# EAGLE design untitled (EAGLE 7.2.0)
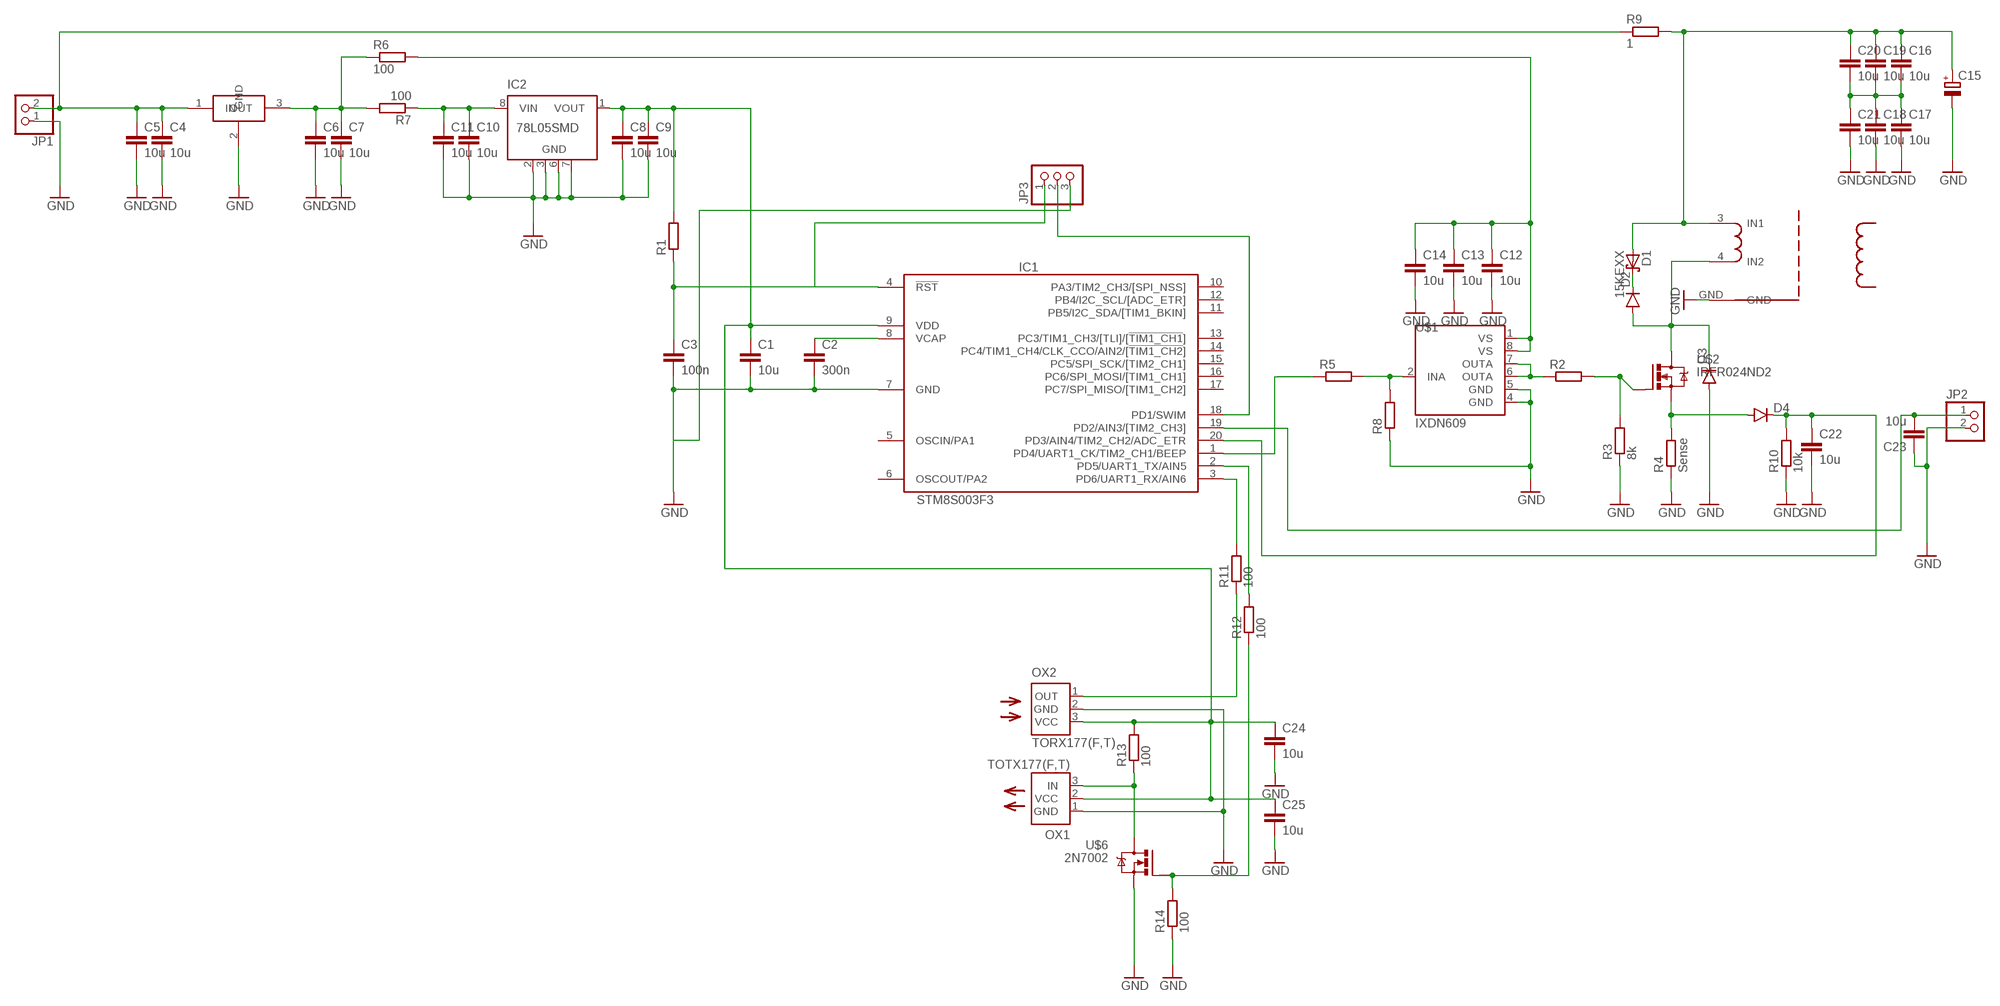
[diagram p0: schematic, sheet 1]

## Parts
C1  10u  CC0805  [C0805]
C2  300n  CC0805  [C0805]
C3  100n  CC0805  [C0805]
C4  10u  CC0805  [C0805]
C5  10u  CC0805  [C0805]
C6  10u  CC0805  [C0805]
C7  10u  CC0805  [C0805]
C8  10u  CC0805  [C0805]
C9  10u  CC0805  [C0805]
C10  10u  CC0805  [C0805]
C11  10u  CC0805  [C0805]
C12  10u  CC0805  [C0805]
C13  10u  CC0805  [C0805]
C14  10u  CC0805  [C0805]
C15  CPOL-EUE7.5-16  [E7,5-16]
C16  10u  CC0805  [C0805]
C17  10u  CC0805  [C0805]
C18  10u  CC0805  [C0805]
C19  10u  CC0805  [C0805]
C20  10u  CC0805  [C0805]
C21  10u  CC0805  [C0805]
C22  10u  CC0805  [C0805]
C23  10u  CC0805  [C0805]
C24  10u  CC0805  [C0805]
C25  10u  CC0805  [C0805]
D1  15KEXX  [CB429-17]
D2  DIODESMA  [SMA-DIODE]
D3  DIODESMA  [SMA-DIODE]
D4  DIODESOD123  [SOD-123]
IC1  STM8S003F3  [TSSOP20]
IC2  78L05SMD  [SO08]
JP1  PINHD-1X2  [1X02]
JP2  PINHD-1X2  [1X02]
JP3  PINHD-1X3  [1X03]
OX1  TOTX177(F,T)  [TOTX]
OX2  TORX177(F,T)  [TORX]
R1  R0603  [0603]
R2  R0805  [R0805]
R3  8k  R0805  [R0805]
R4  Sense  RR2512  [R2512]
R5  R0805  [R0805]
R6  100  R0805  [R0805]
R7  100  R0805  [R0805]
R8  R0805  [R0805]
R9  1  R1206  [R1206]
R10  10k  R0805  [R0805]
R11  100  R0603  [0603]
R12  100  R0603  [0603]
R13  100  R0603  [0603]
R14  100  R0603  [0603]
U$1  IXDN609  [SO08]
U$2  IRFR024ND2  [D2PACK]
U$3  TVS-90P6  [TVS-90P6]
U$4  L7805C2T  [D2PACK]
U$6  2N7002  [SOT23]

## Nets
GND: C1.2 C2.2 C3.2 C4.2 C5.2 C6.2 C7.2 C8.2 C9.2 C10.2 C11.2 C12.2 C13.2 C14.2 C15.- C17.2 C18.2 C21.2 C22.2 C23.1 C24.2 C25.2 D3.A IC1.7(GND) IC2.2(GND) IC2.3(GND) IC2.6(GND) IC2.7(GND) JP1.1 JP2.2 JP3.3 OX1.1(GND) OX2.2(GND) R3.1 R4.1 R8.1 R10.1 R14.1 U$1.4(GND) U$1.5(GND) U$3.GND U$4.2(GND) U$6.2(S)
N$1: C3.1 IC1.4(!RST) JP3.1 R1.1
N$2: C12.1 C13.1 C14.1 R6.2 U$1.1(VS) U$1.8(VS)
N$3: C2.1 IC1.8(VCAP)
N$4: C15.+ C16.1 C19.1 C20.1 D1.A R9.2 U$3.3(IN1)
N$5: D1.C D2.C
N$6: R5.2 R8.2 U$1.2(INA)
N$7: R2.1 U$1.6(OUTA) U$1.7(OUTA)
N$8: R2.2 R3.2 U$2.1(G)
N$9: D2.A D3.C U$2.2(D) U$3.4(IN2)
N$10: C4.1 C5.1 JP1.2 R9.1 U$4.1(IN)
N$11: D4.A R4.2 U$2.3(S)
N$12: C22.1 D4.C IC1.20(PD3/AIN4/TIM2_CH2/ADC_ETR) R10.2
N$13: C23.2 IC1.19(PD2/AIN3/[TIM2_CH3]) JP2.1
N$14: IC1.1(PD4/UART1_CK/TIM2_CH1/BEEP) R5.1
N$15: IC1.3(PD6/UART1_RX/AIN6) R11.2
N$16: C16.2 C17.1 C18.1 C19.2 C20.2 C21.1
N$17: R12.1 R14.2 U$6.1(G)
N$18: C1.1 C8.1 C9.1 C24.1 C25.1 IC1.9(VDD) IC2.1(VOUT) OX1.2(VCC) OX2.3(VCC) R1.2 R13.2
N$19: C10.1 C11.1 IC2.8(VIN) R7.1
N$20: OX2.1(OUT) R11.1
N$21: C6.1 C7.1 R6.1 R7.2 U$4.3(OUT)
N$22: OX1.3(IN) R13.1 U$6.3(D)
N$23: IC1.2(PD5/UART1_TX/AIN5) R12.2
N$26: IC1.18(PD1/SWIM) JP3.2
Unconnected: IC1.5(OSCIN/PA1) IC1.6(OSCOUT/PA2) IC1.10(PA3/TIM2_CH3/[SPI_NSS]) IC1.11(PB5/I2C_SDA/[TIM1_BKIN]) IC1.12(PB4/I2C_SCL/[ADC_ETR]) IC1.13(PC3/TIM1_CH3/[TLI]/[!TIM1_CH1!]) IC1.14(PC4/TIM1_CH4/CLK_CCO/AIN2/[!TIM1_CH2!]) IC1.15(PC5/SPI_SCK/[TIM2_CH1]) IC1.16(PC6/SPI_MOSI/[TIM1_CH1]) IC1.17(PC7/SPI_MISO/[TIM1_CH2]) IC2.4(NC) IC2.5(NC)

## Library data of the parts
C1-C14 C16-C25 = CasaLibrary:C: Capacitor
C15 = rcl:CPOL-EU: POLARIZED CAPACITOR, European symbol
D1 = diode:15KEXX: DIODE
D2-D4 = SparkFun-DiscreteSemi:DIODE: Diode These are standard reverse protection diodes and small signal diodes. SMA package can handle up to about 1A. SOD-323 can handle about 200mA. What the SOD-323 package when ordering, there are some mfgs out there that are 5-pin packages.
IC1 = CasaLibrary:STM8S003: Value line, 16 MHz STM8S 8-bit MCU, 8 Kbytes Flash, 128 bytes data EEPROM, 10-bit ADC, 3 timers, UART, SPI, I2C
IC2 = linear:78L*SMD: Positive VOLTAGE REGULATOR
JP1 JP2 = pinhead:PINHD-1X2: PIN HEADER
JP3 = pinhead:PINHD-1X3: PIN HEADER
OX1 = CasaLibrary:TOTX177(F,T): FIBER OPTIC TRANSMITTING MODULE
OX2 = CasaLibrary:TORX177(F,T): FIBER OPTIC RECEIVING MODULE
R1-R3 R5-R14 = CasaLibrary:R
R4 = eagle-ltspice:R: RESISTOR, European symbol; SPICEMODEL: NONE; SPICEPREFIX: R
U$1 = CasaLibrary:IXDN609
U$2 = CasaLibrary:IRFR024N
U$3 = connectors:TVS-90P6
U$4 = stabil:L7805C2T
U$6 = CasaLibrary:2N7002

## Board
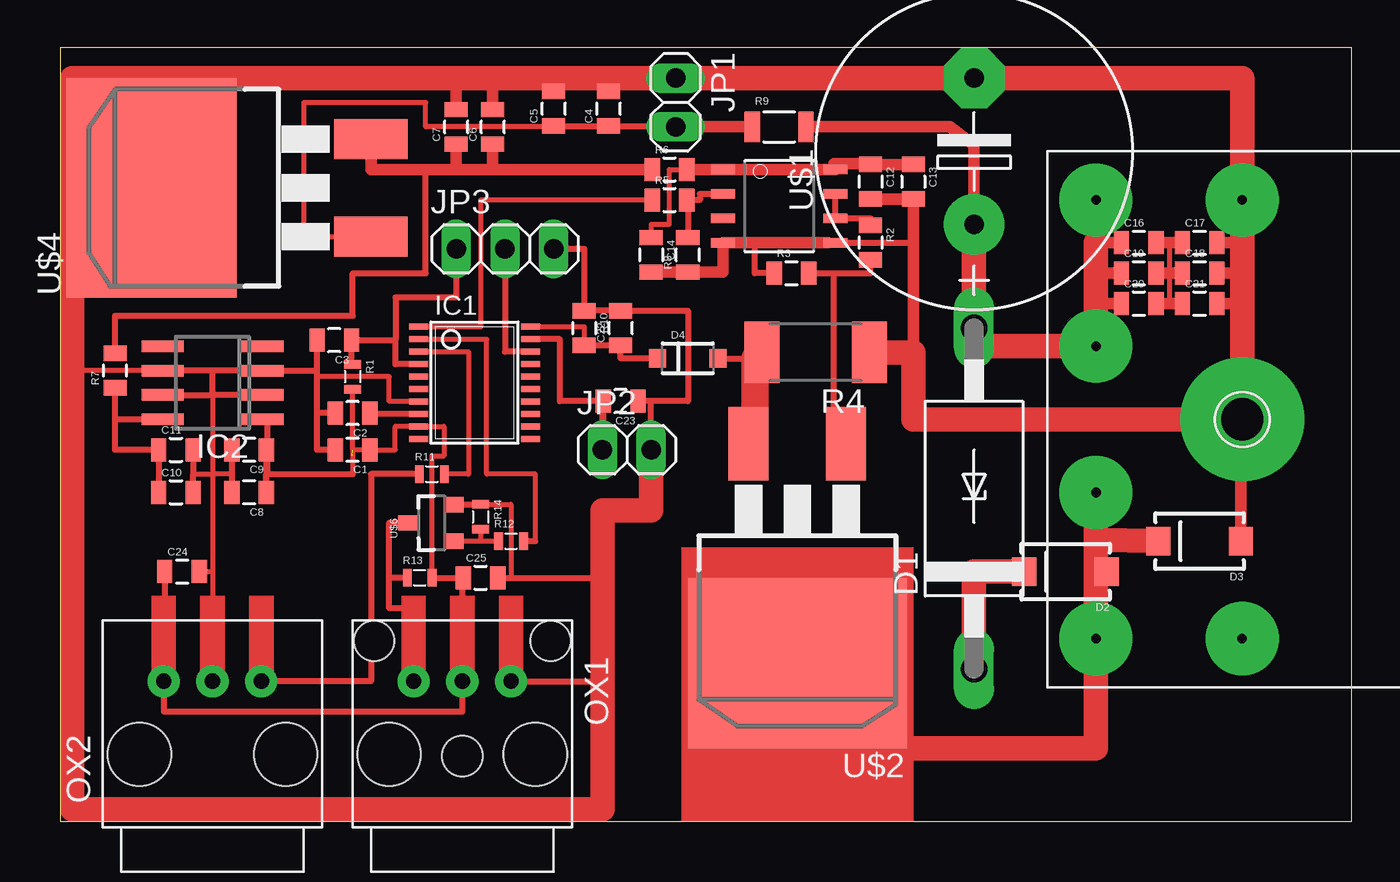
[diagram p1: board, top side]

Size 67.29 x 40.31 mm. Coordinates in mm from the lower left corner, seen from the top.
Outline: 0,0 67.29,0 67.29,40.31 0,40.31 0,0
Copper layers (1*16): Top 0.035mm / dielectric 1.5mm / Bottom 0.035mm
Design rules "default": minimum track width 0.2mm, minimum drill 0.2mm, track to track 0.2mm, track to pad 0.2mm, pad to pad 0.2mm, via to via 0.2mm, smd to smd 0.2mm, copper to edge 0.2mm, drill to drill 0.2mm, minimum pad ring 10mil, minimum via ring 8mil, stop-mask expansion 4mil, vias tented up to drill 0mil, thermal gap 10mil

### Footprints (pad centres in the part's own frame; a part is rotated, then mirrored left to right if it is on the bottom)
C0805 = smd 0.8 x 1.2: 1 -0.9,0; 2 0.9,0
E7,5-16 = drill 1.016 pad 3.15: + -3.81,0 | drill 1.016 pad 3.15 octagon: - 3.81,0
CB429-17 = drill 1.397 long: A 8.89,0; C -8.89,0
SMA-DIODE = smd 1.27 x 1.47: A -2.15,0; C 2.15,0
SOD-123 = smd 0.9 x 0.95: A 1.575,0; C -1.575,0
TSSOP20 = smd 0.305 x 0.991: 1 -2.925,-2.918; 2 -2.275,-2.918; 3 -1.625,-2.918; 4 -0.975,-2.918; 5 -0.325,-2.918; 6 0.325,-2.918; 7 0.975,-2.918; 8 1.625,-2.918; 9 2.275,-2.918; 10 2.925,-2.918; 11 2.925,2.918; 12 2.275,2.918; 13 1.625,2.918; 14 0.975,2.918; 15 0.325,2.918; 16 -0.325,2.918; 17 -0.975,2.918; 18 -1.625,2.918; 19 -2.275,2.918; 20 -2.925,2.918
SO08 = smd 0.6 x 2.2: 1 -1.905,-2.6; 2 -0.635,-2.6; 3 0.635,-2.6; 4 1.905,-2.6; 5 1.905,2.6; 6 0.635,2.6; 7 -0.635,2.6; 8 -1.905,2.6
1X02 = drill 1.016 long: 1 -1.27,0; 2 1.27,0
1X03 = drill 1.016 long: 1 -2.54,0; 2 0,0; 3 2.54,0
TOTX = drill 0.8 pad 1.676: 1 -3.81,2.54; 2 -3.81,0; 3 -3.81,-2.54 | hole 3.3: 0,-3.81; 0,3.81 | hole 2.1: 0.09,0; -5.91,4.6; -5.91,-4.6
TORX = drill 0.8 pad 1.676: 1 3.81,-2.54; 2 3.81,0; 3 3.81,2.54 | hole 3.3: 0,3.81; 0,-3.81
0603 = smd 0.45 x 0.9: 1 -0.65,0; 2 0.65,0
R0805 = smd 0.8 x 1.2: 1 -0.9,0; 2 0.9,0
R2512 = smd 1.8 x 3.2: 1 -2.8,0; 2 2.8,0
R1206 = smd 0.8 x 1.6: 1 -1.4,0; 2 1.4,0
SO08' = smd 0.5 x 1.25: 1 -1.905,-2.934; 2 -0.635,-2.934; 3 0.635,-2.934; 4 1.905,-2.934; 5 1.905,2.934; 6 0.635,2.934; 7 -0.635,2.934; 8 -1.905,2.934
D2PACK = smd 2.083 x 3.81: 1 -2.54,-8.89; 3 2.54,-8.89 | smd 11.43 x 8.89: 2 0,2.54
TVS-90P6 = drill 0.5 pad 3.81: 1 10.16,25.4; 2 2.54,25.4; 3 2.54,17.78; 4 2.54,10.16; 5 2.54,2.54; 6 10.16,2.54 | drill 2.2 pad 6.452: GND 10.16,13.97
SOT23 = smd 0.8 x 1: 1 -0.95,-1.159; 2 0.95,-1.159; 3 0,1.259

### Placement (x,y rotation side)
C1  15.24,19.37 180 top
C2  15.24,21.27 180 top
C3  14.29,25.08 180 top
C4  28.57,37.15 90 top
C5  25.72,37.15 90 top
C6  22.54,36.2 90 top
C7  20.64,36.2 90 top
C8  9.84,17.14 180 top
C9  9.84,19.37 180 top
C10  6.03,17.14 0 top
C11  6.03,19.37 0 top
C12  42.23,33.34 270 top
C13  44.45,33.34 270 top
C14  30.8,29.53 270 top
C15  47.62,34.92 90 top
C16  56.2,30.16 0 top
C17  59.37,30.16 0 top
C18  59.37,28.57 0 top
C19  56.2,28.57 0 top
C20  56.2,26.99 0 top
C21  59.37,26.99 0 top
C22  29.21,25.72 90 top
C23  29.21,21.91 180 top
C24  6.35,13.02 0 top
C25  21.91,12.7 0 top
D1  47.62,16.83 90 top
D2  52.39,13.02 180 top
D3  59.37,14.61 180 top
D4  32.7,24.13 0 top
IC1  21.59,22.86 270 top
IC2  7.94,22.86 90 top
JP1  32.07,37.47 270 top
JP2  29.53,19.37 0 top
JP3  23.18,29.84 0 top
OX1  20.95,3.49 270 top
OX2  7.94,3.49 90 top
R1  15.24,23.18 270 top
R2  42.23,30.16 270 top
R3  38.1,28.57 0 top
R4  39.37,24.45 180 top
R5  31.75,32.38 0 top
R6  31.75,33.97 0 top
R7  2.86,23.5 90 top
R8  32.7,29.53 90 top
R9  37.47,36.2 0 top
R10  27.3,25.72 270 top
R11  19.37,18.1 0 top
R12  23.5,14.61 0 top
R13  18.73,12.7 0 top
R14  21.91,15.88 270 top
U$1  IXDN609  [SO08']  37.47,32.07 270 top
U$2  38.42,10.79 180 top
U$3  51.44,6.99 0 top
U$4  7.3,33.02 90 top
U$6  19.37,15.56 90 top

### Tracks (layer width: path | path; a pad name or v marks a point on that pad's centre or on a via)
GND
  Top 0.254: IC2.6 0.64,23.5 | 7.94,13.02 OX2.2 | C24.2 7.94,13.02 | 7.94,22.23 7.94,18.1 | 7.94,18.1 7.94,13.02 | 6.93,18.1 7.94,18.1 | 8.94,18.1 7.94,18.1 | IC1.7 17.14,21.89 17.14,23.18 13.39,23.18 | 23.5,12.7 23.5,16.52 R14.1
  Top 0.305: 7.94,23.5 IC2.6 | IC2.7 7.94,22.23 | 7.94,22.23 7.94,23.5 | 7.94,23.5 IC2.3 13.39,23.5 | 40.01,30.16 U$1.5 44.45,30.16 | R3.1 36.2,28.57 36.2,30.16 | U$4.2 0.64,33.34 0.64,33.02 | JP2.2 30.8,21.91 | 30.8,21.91 C23.1 | JP3.3 27.3,29.84 R10.1 C22.2 32.7,26.62 32.7,21.91 30.8,21.91 | C8.2 8.94,18.1 C9.2 | C11.2 6.93,18.1 C10.2 | IC2.2 7.94,22.23 | OX1.1 28.26,7.3 | C5.2 25.72,38.73 | C4.2 28.57,38.73 | 13.39,23.5 C3.2 | C2.2 13.39,21.27 | 13.39,21.27 13.39,23.18 13.39,23.5 | C1.2 13.39,19.37 13.39,21.27 | U$6.2 21.91,16.51 R14.1 | C25.2 23.5,12.7 28.26,12.7 28.26,12.38
  Top 0.61: 40.01,30.16 36.2,30.16 U$1.4 34.53,28.63 R8.1 C14.2 | C12.2 C13.2 44.45,30.16 44.45,24.45 | C17.2 61.59,30.16 | C18.2 61.59,28.57 | C21.2 61.59,26.99 | C7.2 20.64,38.73 | C6.2 22.54,38.73 | D3.A 61.52,20.95
  Top 1.27: 61.59,20.32 U$3.GND | U$3.GND 61.59,26.99 61.59,28.57 61.59,30.16 61.59,38.73 C15.- JP1.1 28.57,38.73 25.72,38.73 22.54,38.73 20.64,38.73 0.64,38.73 0.64,33.02 0.64,23.5 0.64,0.64 28.26,0.64 28.26,7.3 28.26,12.38 28.26,16.19 30.8,16.19 JP2.2 | U$3.GND 61.52,20.95 44.45,20.95 44.45,24.45 R4.1
N$1
  Top 0.305: 17.48,25.08 C3.1 15.19,23.83 R1.1 | IC1.4 17.48,23.84 17.48,25.08 | JP3.1 20.64,27.3 17.48,27.3 17.48,25.08
N$2
  Top 0.254: R6.2 31.75,33.97 31.75,31.11 30.8,31.11 C14.1
  Top 0.305: 41.59,34.29 C12.1
  Top 0.61: C13.1 C12.1 | R6.2 U$1.1 U$1.8 40.32,33.97 40.32,34.29 41.59,34.29
N$3
  Top 0.305: IC1.8 16.19,21.23 16.19,20.95 C2.1
N$4
  Top 0.61: C16.1 53.98,30.16 | C19.1 53.98,28.57 | C20.1 53.98,26.99 | R9.2 46.35,36.2 47.62,35.24 C15.+
  Top 1.27: C15.+ D1.A 47.62,24.77 U$3.3 53.98,26.99 53.98,28.57 53.98,30.16
N$5
  Top 1.27: D2.C 47.62,13.02 D1.C
N$6
  Top 0.305: U$1.2 33.34,32.7 33.34,32.38 R5.2 32.7,32.38 R8.2
N$7
  Top 0.305: U$1.7 U$1.6 42.23,31.43 R2.1
N$8
  Top 0.305: U$2.1 40.32,19.68 40.32,28.57 | 40.32,28.57 42.23,28.57 R2.2 | R3.2 40.32,28.57
N$9
  Top 1.27: 53.98,13.02 53.98,3.81 38.73,3.81 U$2.2 | 53.98,13.02 53.98,14.68 | D3.C 53.98,14.68 | 53.98,14.68 U$3.4 | D2.A 53.98,13.02
N$10
  Top 0.254: 25.72,36.2 19.05,36.2 19.05,37.47 12.7,37.47 12.7,30.48 U$4.1
  Top 0.305: JP1.2 28.57,36.2 | 28.57,36.2 25.72,36.2 C5.1 | C4.1 28.57,36.2
  Top 0.61: JP1.2 R9.1
N$11
  Top 0.305: D4.A 36.2,24.13
  Top 1.422: R4.2 36.2,24.13 36.2,19.68 U$2.3
N$12
  Top 0.254: IC1.20 27.3,25.79 R10.2
  Top 0.305: R10.2 C22.1 29.21,24.13 D4.C
N$13
  Top 0.305: C23.2 28.31,20 JP2.1 28.26,21.91 26.04,21.91 26.04,25.14 IC1.19
N$14
  Top 0.254: IC1.1 21.91,25.79 21.91,32.38 R5.1
N$15
  Top 0.254: IC1.3 21.27,24.48 21.27,18.1 R11.2
N$16
  Top 0.254: 57.78,30.16 57.78,28.57 57.78,26.99
  Top 0.61: C16.2 57.78,30.16 C17.1 | C19.2 57.78,28.57 C18.1 | C20.2 57.78,26.99 C21.1
N$17
  Top 0.254: U$6.1 21.91,14.61 | 21.91,14.61 R12.1 | R14.2 21.91,14.61
  Top 0.305: R12.1
N$18  (1 unrouted)
  Top 0.254: 19.37,12.4 19.37,19.05 20,19.05 20,20.59 IC1.9 17.46,20.59 17.46,19.37 C1.1 15.24,19.37 | 15.24,19.37 15.24,18.1 | 15.24,19.37 R1.2
  Top 0.305: C24.1 5.45,7.67 OX2.3 5.4,5.71 20.95,5.71 OX1.2 20.95,12.38 C25.1 R13.2 19.37,12.4 | C9.1 C8.1 10.74,18.1 10.79,18.1 | IC2.1 10.79,20.95 10.79,18.1 | 10.79,18.1 15.24,18.1
N$19
  Top 0.305: 3.49,20.95 IC2.8 2.86,20.95 | 2.86,20.95 R7.1 | C10.1 C11.1 2.86,19.37 2.86,20.95
N$20
  Top 0.305: R11.1 16.19,18.1 16.19,7.3 OX2.1
N$21
  Top 0.305: R7.2 2.86,26.35 15.24,26.35 15.24,28.57 19.05,28.57 19.05,33.97
  Top 0.61: U$4.3 16.19,33.97 19.05,33.97 20.64,33.97 | C7.1 20.64,33.97 | R6.1 22.54,33.97 | 22.54,33.97 20.64,33.97 | C6.1 22.54,33.97
N$22
  Top 0.305: OX1.3 18.41,11.11 17.14,11.11 17.14,12.7 | 17.14,12.7 17.14,15.56 U$6.3 | R13.1 17.14,12.7
N$23
  Top 0.254: 24.77,14.61 24.77,18.1 22.23,18.1 22.23,25.14 IC1.2
  Top 0.305: R12.2 24.77,14.61
N$26
  Top 0.305: JP3.2 23.18,24.48 IC1.18
(copper drawn outside any net)
  shapes: Top area x7